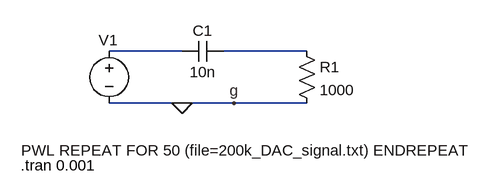
[diagram p0: schematic DAC_pulsSimulate.asc]
DAC_pulsSimulate.asc, the LTspice schematic file:
Version 4
SHEET 1 6500 680
WIRE -48 96 -160 96
WIRE 144 96 16 96
WIRE -48 176 -160 176
WIRE 32 176 -48 176
WIRE 144 176 32 176
FLAG -48 176 0
FLAG 32 176 g
SYMBOL voltage -160 80 R0
WINDOW 0 -16 -1 Left 2
WINDOW 3 -135 169 Left 2
WINDOW 123 -135 197 Left 2
WINDOW 39 0 0 Left 0
SYMATTR InstName V1
SYMATTR Value PWL REPEAT FOR 50 (file=200k_DAC_signal.txt) ENDREPEAT
SYMBOL res 128 80 R0
SYMATTR InstName R1
SYMATTR Value 1000
SYMBOL cap 16 80 R90
WINDOW 0 0 32 VBottom 2
WINDOW 3 32 32 VTop 2
SYMATTR InstName C1
SYMATTR Value 10n
TEXT -296 272 Left 2 !.tran 0.001

The netlist it stands for:
* DAC_pulsSimulate.asc
V1 N001 0 PWL REPEAT FOR 50 (file=200k_DAC_signal.txt) ENDREPEAT
R1 N002 0 1000
C1 N002 N001 10n
.tran 0.001
.backanno
.end